# EAGLE design bitchess (EAGLE 9.6.2)
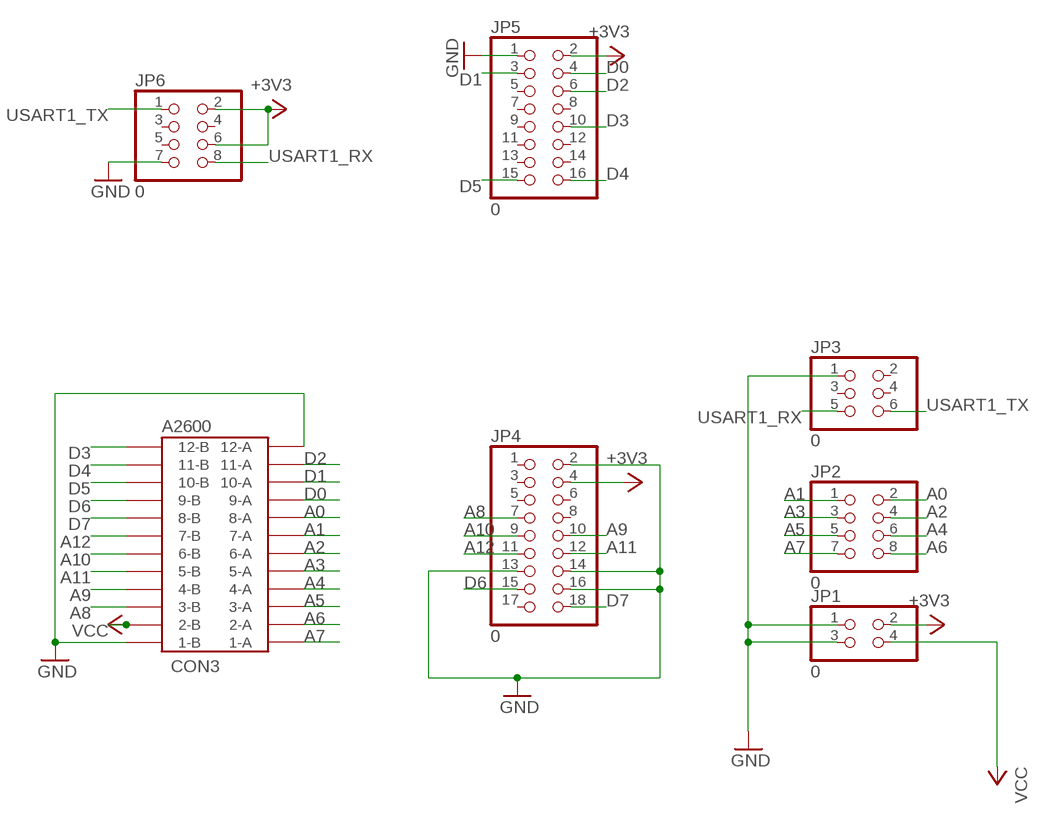
[diagram p0: schematic, sheet 1]

## Parts
CON3  A2600  24PINEDGE-254MM  [24PINEDGE-254MM]
JP1  0  PINHD-2X2  [2X02]
JP2  0  PINHD-2X4  [2X04]
JP3  0  PINHD-2X3  [2X03]
JP4  0  PINHD-2X9  [2X09]
JP5  0  PINHD-2X8  [2X08]
JP6  0  PINHD-2X4  [2X04]

## Nets
+3V3: JP1.2 JP4.4 JP5.2 JP6.2 JP6.6
A0: CON3.8-A JP2.2
A1: CON3.7-A JP2.1
A2: CON3.6-A JP2.4
A3: CON3.5-A JP2.3
A4: CON3.4-A JP2.6
A5: CON3.3-A JP2.5
A6: CON3.2-A JP2.8
A7: CON3.1-A JP2.7
A8: CON3.3-B JP4.7
A9: CON3.4-B JP4.10
A10: CON3.6-B JP4.9
A11: CON3.5-B JP4.12
A12: CON3.7-B JP4.11
D0: CON3.9-A JP5.4
D1: CON3.10-A JP5.3
D2: CON3.11-A JP5.6
D3: CON3.12-B JP5.10
D4: CON3.11-B JP5.16
D5: CON3.10-B JP5.15
D6: CON3.9-B JP4.15
D7: CON3.8-B JP4.18
GND: CON3.1-B CON3.12-A JP1.1 JP1.3 JP3.1 JP4.2 JP4.13 JP4.14 JP4.16 JP5.1 JP6.7
USART1_RX: JP3.5 JP6.8
USART1_TX: JP3.6 JP6.1
VCC: CON3.2-B JP1.4
Unconnected: JP3.2 JP3.3 JP3.4 JP4.1 JP4.3 JP4.5 JP4.6 JP4.8 JP4.17 JP5.5 JP5.7 JP5.8 JP5.9 JP5.11 JP5.12 JP5.13 JP5.14 JP6.3 JP6.4 JP6.5

## Library data of the parts
CON3 = con-edge:24PINEDGE-254MM: 24 PIN EDGE CONNECTOR 2.54mm ATARI 2600 CARTRIDGE PORT
JP1 = pinhead:PINHD-2X2: PIN HEADER
JP2 JP6 = pinhead:PINHD-2X4: PIN HEADER
JP3 = pinhead:PINHD-2X3: PIN HEADER
JP4 = pinhead:PINHD-2X9: PIN HEADER
JP5 = pinhead:PINHD-2X8: PIN HEADER

## Board
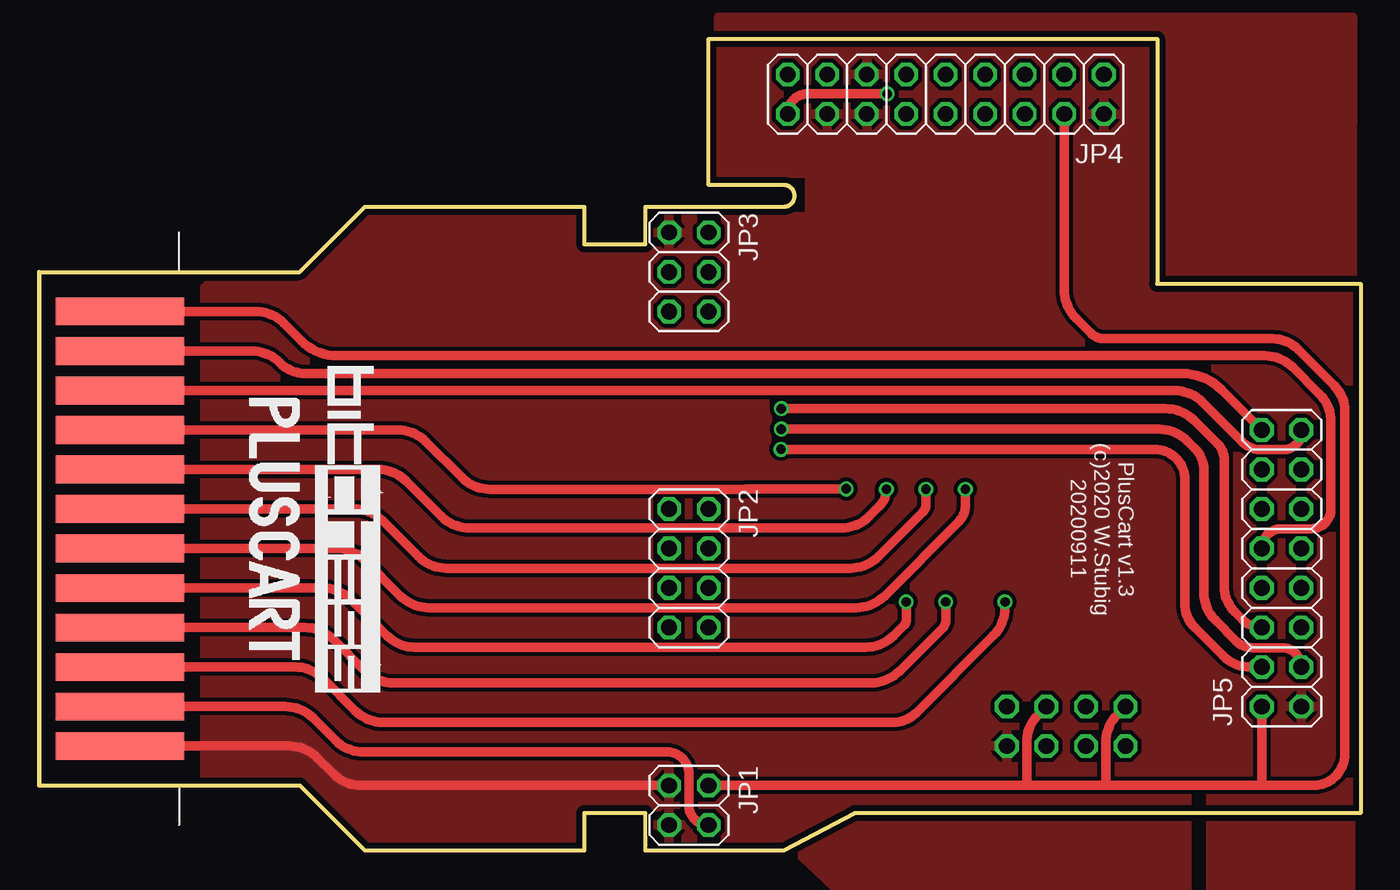
[diagram p1: board, top side]
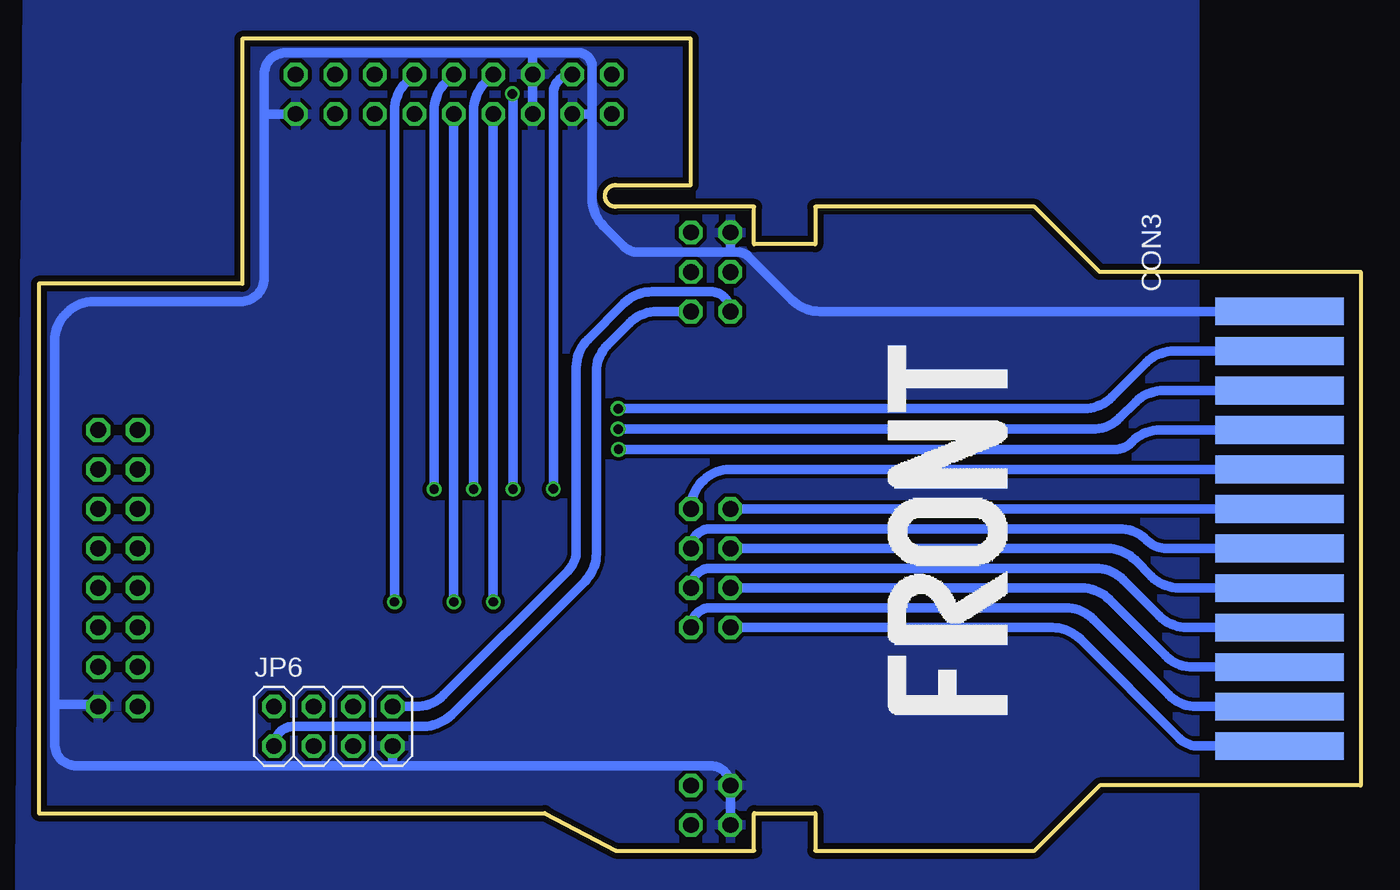
[diagram p2: board, bottom side, seen from below]

Size 84.96 x 52.2 mm. Coordinates in mm from the lower left corner, seen from the top.
Outline: 47.88,42.8 43.05,42.8 43.05,52.2 71.88,52.2 71.88,36.45 84.96,36.45 84.96,2.41 52.45,2.41 47.88,0 38.99,0 38.99,2.41 35.05,2.41 35.05,0 20.95,0 16.76,4.19 0,4.19 0,37.21 16.76,37.21 20.95,41.4 35.05,41.4 35.05,38.99 38.99,38.99 38.99,41.4 47.88,41.4 arc180 47.88,42.8
Copper layers (1*16): Top 0.0356mm / dielectric 1.5011mm / Bottom 0.0356mm
Design rules "OSHPark2layer": minimum track width 6mil, minimum drill 13mil, track to track 6mil, track to pad 6mil, pad to pad 6mil, via to via 6mil, smd to smd 6mil, copper to edge 15mil, drill to drill 6mil, minimum pad ring 7mil, minimum via ring 7mil, stop-mask expansion 3mil, vias tented up to drill 0mil, thermal gap 10mil
tRestrict: area 74.5,-2.9 to 74.5,3.6

### Footprints (pad centres in the part's own frame; a part is rotated, then mirrored left to right if it is on the bottom)
24PINEDGE-254MM = smd 1.778 x 8.255: 1-A -22.86,-7.62; 2-A -20.32,-7.62; 3-A -17.78,-7.62; 4-A -15.24,-7.62; 5-A -12.7,-7.62; 6-A -10.16,-7.62; 7-A -7.62,-7.62; 8-A -5.08,-7.62; 9-A -2.54,-7.62; 10-A 0,-7.62; 11-A 2.54,-7.62; 12-A 5.08,-7.62 | smd 1.778 x 8.255 bottom: 1-B -22.86,-7.62; 2-B -20.32,-7.62; 3-B -17.78,-7.62; 4-B -15.24,-7.62; 5-B -12.7,-7.62; 6-B -10.16,-7.62; 7-B -7.62,-7.62; 8-B -5.08,-7.62; 9-B -2.54,-7.62; 10-B 0,-7.62; 11-B 2.54,-7.62; 12-B 5.08,-7.62
2X02 = drill 1.016 octagon: 1 -1.27,-1.27; 2 -1.27,1.27; 3 1.27,-1.27; 4 1.27,1.27
2X04 = drill 1.016 octagon: 1 -3.81,-1.27; 2 -3.81,1.27; 3 -1.27,-1.27; 4 -1.27,1.27; 5 1.27,-1.27; 6 1.27,1.27; 7 3.81,-1.27; 8 3.81,1.27
2X03 = drill 1.016 octagon: 1 -2.54,-1.27; 2 -2.54,1.27; 3 0,-1.27; 4 0,1.27; 5 2.54,-1.27; 6 2.54,1.27
2X09 = drill 1.016 octagon: 1 -10.16,-1.27; 2 -10.16,1.27; 3 -7.62,-1.27; 4 -7.62,1.27; 5 -5.08,-1.27; 6 -5.08,1.27; 7 -2.54,-1.27; 8 -2.54,1.27; 9 0,-1.27; 10 0,1.27; 11 2.54,-1.27; 12 2.54,1.27; 13 5.08,-1.27; 14 5.08,1.27; 15 7.62,-1.27; 16 7.62,1.27; 17 10.16,-1.27; 18 10.16,1.27
2X08 = drill 1.016 octagon: 1 -8.89,-1.27; 2 -8.89,1.27; 3 -6.35,-1.27; 4 -6.35,1.27; 5 -3.81,-1.27; 6 -3.81,1.27; 7 -1.27,-1.27; 8 -1.27,1.27; 9 1.27,-1.27; 10 1.27,1.27; 11 3.81,-1.27; 12 3.81,1.27; 13 6.35,-1.27; 14 6.35,1.27; 15 8.89,-1.27; 16 8.89,1.27

### Placement (x,y rotation side)
CON3  12.83,29.59 90 bottom
JP1  41.78,2.92 270 top
JP2  41.78,18.16 270 top
JP3  41.78,37.21 270 top
JP4  58.29,48.64 180 top
JP5  79.88,18.16 90 top
JP6  66.04,8 0 bottom

### Tracks (layer width: path | path; a pad name or v marks a point on that pad's centre or on a via)
+3V3
  Top 0.61: JP1.2 63.5,4.19 | 63.5,4.19 68.58,4.19 | 68.58,4.19 78.74,4.19 | JP6.6 64.24,8.74 arc45 63.5,6.95 63.5,4.19 | JP6.2 69.32,8.74 arc45 68.58,6.95 68.58,4.19 | 78.74,4.19 81.91,4.19 arc90 83.95,6.22 83.95,28.29 arc45 83.27,29.91 80.95,32.23 arc45 79.29,32.92 68.48,32.92 arc-45 67.66,33.26 66.66,34.26 arc-45 65.91,36.05 JP4.4 | JP5.2 78.61,4.32 arc90 78.74,4.19
A0
  Bottom 0.61: JP2.2 arc90 40.51,24.51 CON3.8-A
A1
  Bottom 0.61: JP2.1 CON3.7-A
A2
  Bottom 0.61: JP2.4 arc90 41.78,20.7 15.53,20.7 arc45 13.73,19.96 arc-45 12.46,19.43 CON3.6-A
A3
  Bottom 0.61: JP2.3 16.29,19.43 arc45 14.5,18.69 13.44,17.64 arc-45 11.65,16.89 CON3.5-A
A4
  Bottom 0.61: JP2.6 arc90 41.78,18.16 17.05,18.16 arc45 15.26,17.42 12.94,15.1 arc-45 11.14,14.35 CON3.4-A
A5
  Bottom 0.61: JP2.5 17.94,16.89 arc45 16.15,16.15 12.55,12.55 arc-45 10.76,11.81 CON3.3-A
A6
  Bottom 0.61: JP2.8 arc90 41.78,15.62 18.98,15.62 arc45 17.19,14.88 12.33,10.02 arc-45 10.53,9.27 CON3.2-A
A7
  Bottom 0.61: JP2.7 19.82,14.35 arc45 18.03,13.61 11.66,7.24 arc-45 10.43,6.73 CON3.1-A
A8  (via drill 0.6)
  Top 0.61: CON3.3-B 16.47,11.81 arc-45 18.27,11.07 20.34,9 arc45 22.13,8.26 54.9,8.26 arc45 56.4,8.87 61.36,13.84 arc45 62.1,15.63 v62.1,16
  Bottom 0.61: JP4.7 61.36,49.38 arc-45 62.1,47.59 v62.1,16
A9  (via drill 0.6)
  Top 0.61: CON3.4-B 17.11,14.35 arc-45 18.9,13.61 20.97,11.54 arc45 22.77,10.79 53.51,10.79 arc45 55.3,11.54 58.13,14.37 arc45 58.29,14.76 v58.29,16
  Bottom 0.61: JP4.10 v58.29,16
A10  (via drill 0.6)
  Top 0.61: CON3.6-B 19.14,19.43 arc-45 20.94,18.69 23.26,16.37 arc45 25.05,15.62 52.54,15.62 arc45 54.34,16.37 59.13,21.16 arc45 59.56,22.2 v59.56,23.24
  Bottom 0.61: JP4.9 58.82,49.38 arc-45 59.56,47.59 v59.56,23.24
A11  (via drill 0.6)
  Top 0.61: CON3.5-B 18.25,16.89 arc-45 20.05,16.15 22.37,13.82 arc45 24.17,13.08 53.15,13.08 arc45 54.95,13.82 55.63,14.5 arc45 55.75,14.81 v55.75,16
  Bottom 0.61: JP4.12 v55.75,16
A12  (via drill 0.6)
  Top 0.61: CON3.7-B 20.28,21.97 arc-45 22.08,21.23 24.4,18.91 arc45 26.2,18.16 52.16,18.16 arc45 53.96,18.91 56.83,21.77 arc45 57.02,22.25 v57.02,23.24
  Bottom 0.61: JP4.11 56.28,49.38 arc-45 57.02,47.59 v57.02,23.24
D0  (via drill 0.6)
  Top 0.61: JP5.4 77.89,11.81 arc-45 76.09,12.55 74.3,14.35 arc-45 73.66,15.88 73.66,23.88 arc90 71.73,25.81 v47.7,25.81
  Bottom 0.61: v47.7,25.81 15.76,25.81 arc-45 14.78,26.21 14.69,26.31 arc45 12.89,27.05 CON3.9-A
D1  (via drill 0.6)
  Top 0.61: JP5.3 arc90 79.91,13.06 77.98,13.06 arc-45 76.98,13.47 75.62,14.83 arc-45 74.88,16.62 74.88,24.51 arc45 74.32,25.86 73.82,26.36 arc45 72.02,27.1 v47.73,27.1
  Bottom 0.61: v47.73,27.1 17.26,27.1 arc-45 15.46,27.85 14.46,28.85 arc45 12.66,29.59 CON3.10-A
D2  (via drill 0.6)
  Top 0.61: v47.73,28.42 72.45,28.42 arc-45 74.25,27.68 75.79,26.14 arc-45 76.2,25.16 76.2,17 arc45 76.89,15.34 77.36,14.87 arc45 JP5.6
  Bottom 0.61: v47.73,28.42 17.79,28.42 arc-45 15.99,29.17 13.77,31.39 arc45 11.98,32.13 CON3.11-A
D3
  Top 0.61: CON3.12-B 13.93,34.67 arc-45 15.73,33.93 16.89,32.77 arc45 19.16,31.83 78.8,31.83 arc-45 80.6,31.08 82.31,29.37 arc-45 83.06,27.57 83.06,21.97 arc-90 81.79,20.7 79.88,20.7 arc90 JP5.10
D4
  Top 0.61: CON3.11-B 13.68,32.13 arc-45 15.48,31.39 15.49,31.37 arc45 17.15,30.68 73.5,30.68 arc-45 76.03,29.63 JP5.16
D5
  Top 0.61: CON3.10-B 72.99,29.59 arc-45 74.78,28.85 77.31,26.32 arc45 78.61,25.78 78.83,25.78 80.01,25.78 arc90 81.15,26.92 JP5.15
D6  (via drill 0.6)
  Top 0.61: CON3.9-B 23.08,27.05 arc-45 24.87,26.31 27.2,23.99 arc45 28.99,23.24 45.44,23.24 45.47,23.27 v51.89,23.27
  Bottom 0.61: JP4.15 arc-90 51.89,48.69 v51.89,23.27
D7  (via drill 0.6)
  Top 0.61: CON3.8-B 21.81,24.51 arc-45 23.6,23.77 25.88,21.5 arc45 27.67,20.75 51.59,20.75 arc45 53.37,21.49 54.03,22.16 arc45 v54.48,23.24 | JP4.18 arc-90 49.43,48.67 v54.53,48.67
  Bottom 0.61: v54.48,23.24 54.48,48.62 arc-90 v54.53,48.67
GND
  Top 0.61: CON3.1-B 16.09,6.73 arc-45 17.89,5.99 18.94,4.93 arc45 20.74,4.19 JP1.1
  Bottom 0.61: 40.51,38.48 39.98,38.48 arc45 39.37,38.23 36.56,35.41 arc-45 34.76,34.67 CON3.12-A | JP3.1 40.51,38.48 | 53.34,51.31 50.29,51.31 arc90 49.4,50.42 49.4,47.37 | 53.34,51.31 69.09,51.31 arc-90 70.48,49.91 70.48,47.37 | 70.48,47.37 70.48,36.83 arc90 72.01,35.31 81.41,35.31 arc-90 83.95,32.77 83.95,9.4 | JP5.1 arc-45 81.46,9.4 83.95,9.4 | JP1.3 JP1.1 arc-90 41.78,5.46 62.23,5.46 | JP4.2 70.48,47.37 | 49.4,47.37 49.4,41.95 arc-45 48.66,40.15 47.38,38.87 arc-45 46.45,38.48 40.51,38.48 | JP4.16 49.4,47.37 | 62.23,5.46 82.55,5.46 arc90 83.95,6.86 83.95,9.4 | JP6.7 62.23,5.46 | JP4.14 JP4.13 53.21,51.18 arc-90 53.34,51.31
  pour Top (isolate 0.254): 10.67,36.2 10.67,4.45 16.64,4.45 17.02,4.45 21.08,0.38 34.54,0.38 34.54,2.92 39.62,2.92 39.62,2.67 39.62,0.51 48.01,0.51 48.01,0.64 52.71,-3.81 84.33,-3.81 84.33,-1.65 84.45,53.59 43.69,53.59 43.69,43.56 49.53,43.56 49.53,40.77 49.4,40.77 39.5,40.77 39.5,38.48 34.54,38.48 34.54,40.77 21.34,40.77 21.34,40.89 16.76,36.32 10.92,36.32 10.79,36.32
  pour Bottom (isolate 0.254): 10.67,54.99 10.67,-0.25 10.67,-5.21 78.99,-5.21 86.23,-5.21 85.72,54.99
USART1_RX
  Bottom 0.61: JP3.5 arc-90 41.78,35.94 45.56,35.94 arc-45 47.35,35.2 49.68,32.88 arc-45 50.42,31.08 50.42,19.3 arc45 50.96,18 58.95,10.02 arc45 60.74,9.27 JP6.8
USART1_TX
  Bottom 0.61: JP6.1 arc90 68.58,8 60.23,8 arc-45 58.44,8.74 49.87,17.32 arc-45 49.12,19.11 49.12,30.83 arc45 48.44,32.49 47,33.93 arc45 45.2,34.67 JP3.6
VCC
  Top 0.61: JP1.4 arc-90 41.78,2.92 41.78,4.95 arc90 40.39,6.35 20.86,6.35 arc-45 19.07,7.09 17.63,8.53 arc45 15.84,9.27 CON3.2-B

### Text on the board
tPlace: PlusCart v1.3 / (c)2020 W.Stubig / 20200911 | /Users/boo/Desktop/bitchess.bmp
bPlace: /Users/boo/Desktop/front.bmp